# EAGLE schematic hdmi (EAGLE 7.3.0)
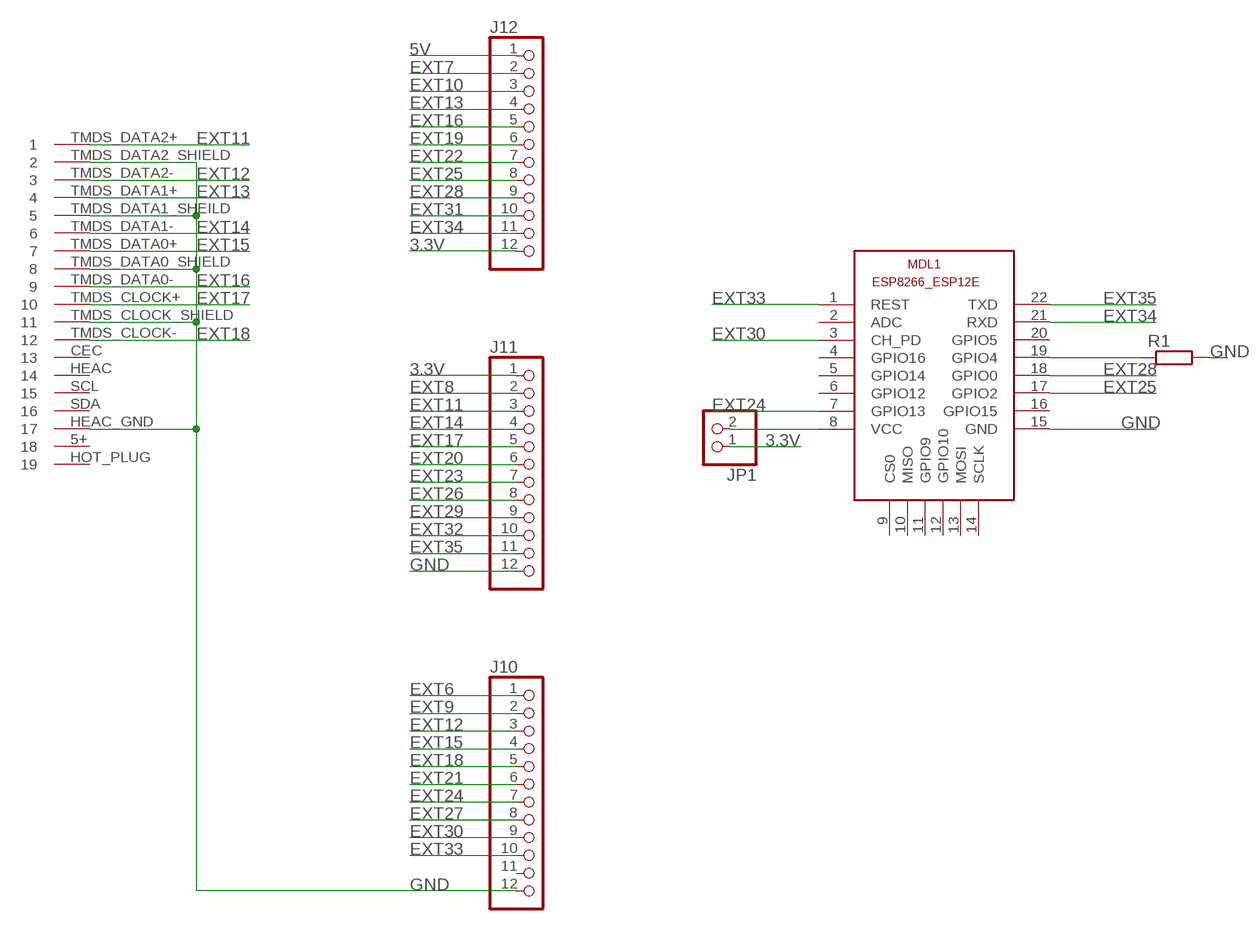
[diagram p0: schematic, sheet 1]

## Parts
J10  PINHD-1X12  [1X12]
J11  PINHD-1X12  [1X12]
J12  PINHD-1X12  [1X12]
JP1  PINHD-1X2/90  [1X02/90]
MDL1  ESP8266-12EESP8266-ESP12E  [ESP8266-ESP12E]
R1  R-EU_M0805  [M0805]
U$2  HDMI  [DS1115]

## Nets
3.3V: J11.1 J12.12 JP1.1
5V: J12.1
EXT6: J10.1
EXT7: J12.2
EXT8: J11.2
EXT9: J10.2
EXT10: J12.3
EXT11: J11.3 U$2.TMDS_DATA2+
EXT12: J10.3 U$2.TMDS_DATA2-
EXT13: J12.4 U$2.TMDS_DATA1+
EXT14: J11.4 U$2.TMDS_DATA1-
EXT15: J10.4 U$2.TMDS_DATA0+
EXT16: J12.5 U$2.TMDS_DATA0-
EXT17: J11.5 U$2.TMDS_CLOCK+
EXT18: J10.5 U$2.TMDS_CLOCK-
EXT19: J12.6
EXT20: J11.6
EXT21: J10.6
EXT22: J12.7
EXT23: J11.7
EXT24: J10.7 MDL1.7(GPIO13)
EXT25: J12.8 MDL1.17(GPIO2)
EXT26: J11.8
EXT27: J10.8
EXT28: J12.9 MDL1.18(GPIO0)
EXT29: J11.9
EXT30: J10.9 MDL1.3(CH_PD)
EXT31: J12.10
EXT32: J11.10
EXT33: J10.10 MDL1.1(REST)
EXT34: J12.11 MDL1.21(RXD)
EXT35: J11.11 MDL1.22(TXD)
GND: J10.12 J11.12 MDL1.15(GND) R1.2 U$2.HEAC_GND U$2.TMDS_CLOCK_SHIELD U$2.TMDS_DATA0_SHIELD U$2.TMDS_DATA1_SHEILD U$2.TMDS_DATA2_SHIELD
N$1: MDL1.19(GPIO4) R1.1
N$2: JP1.2 MDL1.8(VCC)
Unconnected: J10.11 MDL1.2(ADC) MDL1.4(GPIO16) MDL1.5(GPIO14) MDL1.6(GPIO12) MDL1.9(CS0) MDL1.10(MISO) MDL1.11(GPIO9) MDL1.12(GPIO10) MDL1.13(MOSI) MDL1.14(SCLK) MDL1.16(GPIO15) MDL1.20(GPIO5) U$2.5+ U$2.CEC U$2.HEAC U$2.HOT_PLUG U$2.SCL U$2.SDA

## Library data of the parts
J10-J12 = pinhead:PINHD-1X12: PIN HEADER
JP1 = pinhead:PINHD-1X2: PIN HEADER
MDL1 = ESP8266-ESP12E:ESP8266-12E: ESP8266-12E with additional I/O and GPIO04/05 corrected The author cannot warrant that this library is free from error or will meet your specific requirements. Created by PuceBaboon.com. Komagane, Nagano, JAPAN
R1 = rcl:R-EU_: RESISTOR, European symbol
U$2 = Connfly:HDMI: HDMI Socket